# EAGLE design untitled (EAGLE 6.6.0)
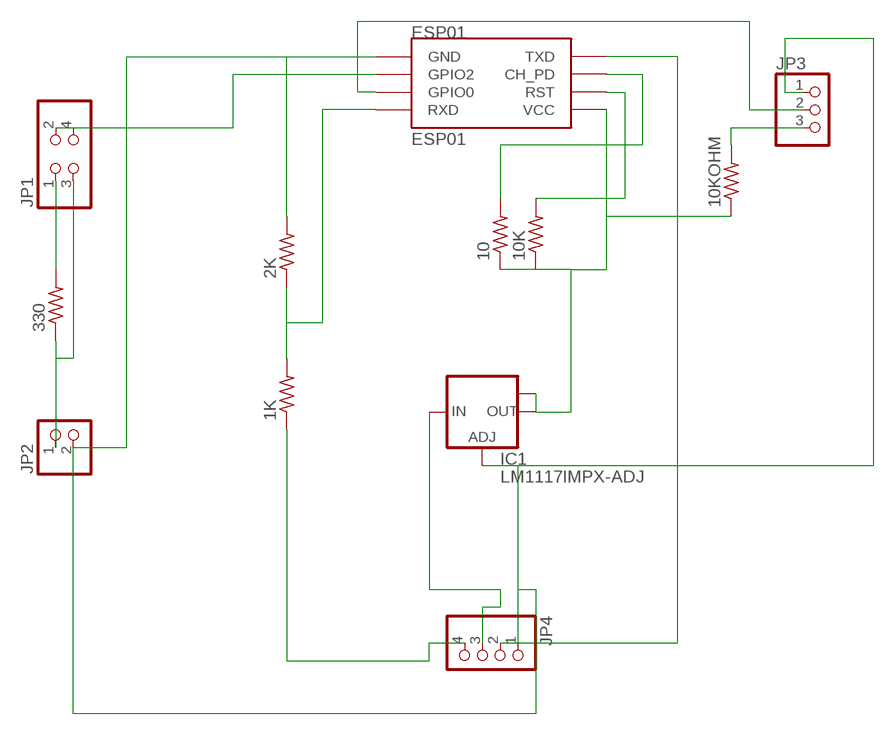
[diagram p0: schematic, sheet 1]

## Parts
1K  R-US_0204/7  [0204/7]
2K  R-US_0204/7  [0204/7]
10  R-US_0204/7  [0204/7]
10K  R-US_0204/7  [0204/7]
10KOHM  R-US_0204/7  [0204/7]
330  R-US_0204/7  [0204/7]
ESP01  ESP01  [ESP01]
IC1  LM1117IMPX-ADJ  [SOT223]
JP1  PINHD-2X2  [2X02]
JP2  PINHD-1X2  [1X02]
JP3  PINHD-1X3  [1X03]
JP4  PINHD-1X4  [1X04]

## Nets
N$1: 330.2 JP1.1
N$2: 330.1 JP1.3 JP2.1
N$3: 1K.2 2K.1 ESP01.RX(RXD)
N$5: 10.1 10K.1 10KOHM.1 ESP01.VCC IC1.2(OUT) IC1.TAB(OUT1)
N$6: 1K.1 JP4.4
N$7: ESP01.GPIO2 JP1.2 JP1.4
N$8: 10.2 ESP01.CH_PD
N$9: 10K.2 ESP01.RST
N$10: IC1.3(IN) JP4.3
N$11: 2K.2 ESP01.GND IC1.1(ADJ) JP2.2 JP3.1 JP4.1
N$12: ESP01.TX(TXD) JP4.2
N$13: ESP01.GPIO0 JP3.2
N$14: 10KOHM.2 JP3.3

## Library data of the parts
1K 2K 10 10K 10KOHM 330 = resistor:R-US_: RESISTOR, American symbol
ESP01 = esp8266modules:ESP01: ESP8266 Wifi module 01
IC1 = lm1117:LM1117IMPX-ADJ
JP1 = pinhead:PINHD-2X2: PIN HEADER
JP2 = pinhead:PINHD-1X2: PIN HEADER
JP3 = pinhead:PINHD-1X3: PIN HEADER
JP4 = pinhead:PINHD-1X4: PIN HEADER

## Board
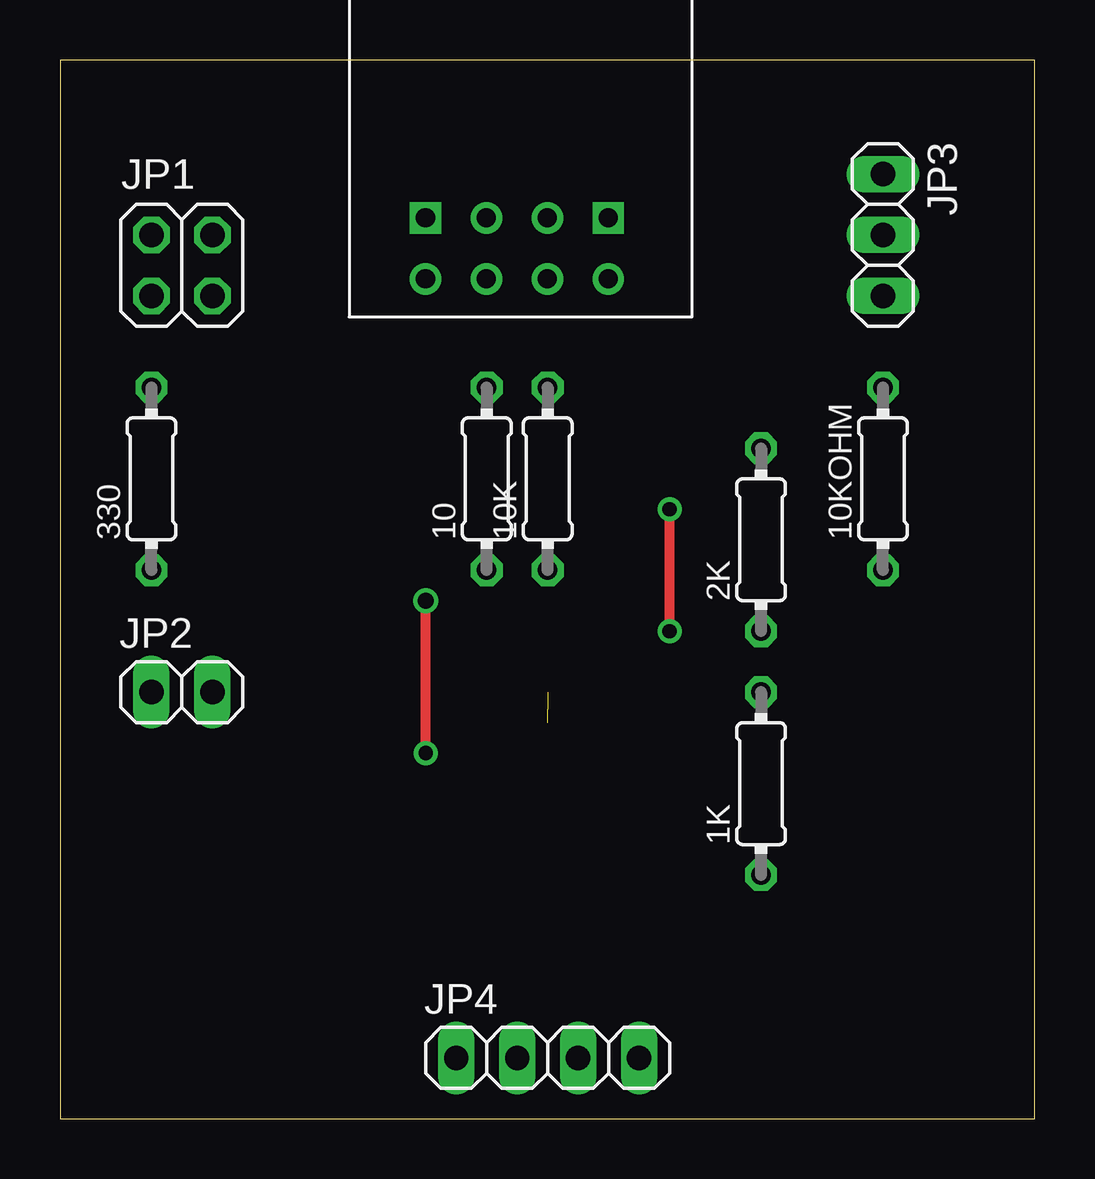
[diagram p1: board, top side]
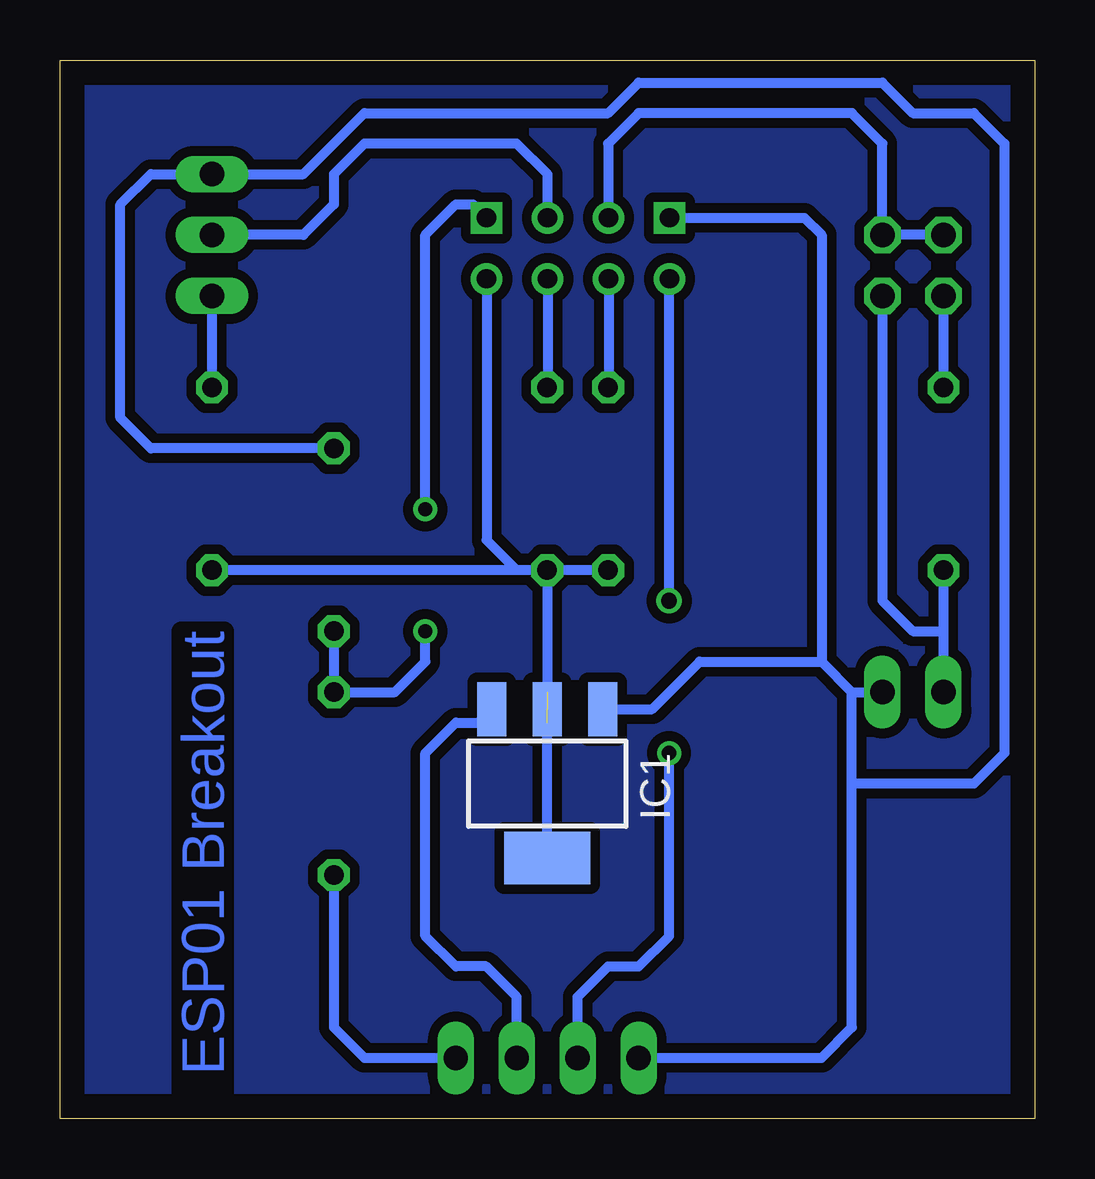
[diagram p2: board, bottom side, seen from below]

Size 40.62 x 44.12 mm. Coordinates in mm from the lower left corner, seen from the top.
Outline: 0,0 40.62,0 40.62,44.12 0,44.12 0,0
Copper layers (1*16): Top 0.035mm / dielectric 1.5mm / Bottom 0.035mm
Design rules "default": minimum track width 10mil, minimum drill 24mil, track to track 8mil, track to pad 8mil, pad to pad 8mil, via to via 8mil, smd to smd 8mil, copper to edge 40mil, drill to drill 8mil, minimum pad ring 10mil, minimum via ring 8mil, stop-mask expansion 4mil, vias tented up to drill 0mil, thermal gap 10mil

### Footprints (pad centres in the part's own frame; a part is rotated, then mirrored left to right if it is on the bottom)
0204/7 = drill 0.813 octagon: 1 -3.81,0; 2 3.81,0
ESP01 = drill 0.8: CH_PD -1.285,-8.178; GPIO0 1.255,-5.638; GPIO2 -1.285,-5.638; RST 1.255,-8.178; TX -3.825,-8.178; VCC 3.795,-8.178 | drill 0.8 square: GND -3.825,-5.638; RX 3.795,-5.638
SOT223 = smd 1.219 x 2.235: 1 -2.311,-3.099; 2 0,-3.099; 3 2.311,-3.099 | smd 3.6 x 2.2: TAB 0,3.099
2X02 = drill 1.016 octagon: 1 -1.27,-1.27; 2 -1.27,1.27; 3 1.27,-1.27; 4 1.27,1.27
1X02 = drill 1.016 long: 1 -1.27,0; 2 1.27,0
1X03 = drill 1.016 long: 1 -2.54,0; 2 0,0; 3 2.54,0
1X04 = drill 1.016 long: 1 -3.81,0; 2 -1.27,0; 3 1.27,0; 4 3.81,0

### Placement (x,y rotation side)
1K  29.21,13.97 90 top
2K  29.21,24.13 90 top
10  17.78,26.67 90 top
10K  20.32,26.67 90 top
10KOHM  34.29,26.67 90 top
330  3.81,26.67 90 top
ESP01  19.05,43.18 0 top
IC1  20.32,13.97 180 bottom
JP1  5.08,35.56 0 top
JP2  5.08,17.78 0 top
JP3  34.29,36.83 270 top
JP4  20.32,2.54 0 top

### Tracks (layer width: path | path; a pad name or v marks a point on that pad's centre or on a via)
GND
  pour Bottom (isolate 0.406): 0,44.45 40.64,44.45 40.64,43.18 40.64,0 0,0 0,1.27
N$1
  Bottom 0.406: JP1.1 330.2
N$2
  Bottom 0.406: 330.1 3.81,20.32 | 3.81,20.32 JP2.1 | JP1.3 6.35,21.59 5.08,20.32 3.81,20.32
N$3  (via drill 0.6)
  Top 0.406: v25.4,20.32 v25.4,25.4
  Bottom 0.406: 2K.1 1K.2 26.67,17.78 25.4,19.05 v25.4,20.32 | v25.4,25.4 25.4,36.83 24.13,38.1 23.4,38.1 ESP01.RX
N$5  (2 unrouted)
  Bottom 0.406: 10.1 10K.1 | 10K.1 21.59,22.86 | 21.59,22.86 10KOHM.1 | 10K.1 20.32,16.51 | IC1.TAB 20.32,17.78 | ESP01.VCC 22.85,24.11 21.59,22.86
N$6
  Bottom 0.406: 1K.1 29.21,3.81 27.94,2.54 JP4.4
N$7
  Bottom 0.406: JP1.2 JP1.4 6.35,40.64 7.62,41.91 16.51,41.91 17.78,40.64 17.78,37.56 ESP01.GPIO2
N$8
  Bottom 0.406: ESP01.CH_PD 17.76,30.5 10.2
N$9
  Bottom 0.406: ESP01.RST 20.3,30.5 10K.2
N$10
  Bottom 0.406: JP4.3 21.59,5.08 22.86,6.35 24.13,6.35 25.4,7.62 25.4,15.24 24.13,16.51 23.19,16.51 IC1.3
N$11
  Bottom 0.406: ESP01.GND 9.6,37.54 8.89,36.83 8.89,19.05 | 8.89,19.05 7.62,17.78 | 7.62,17.78 JP2.2 | IC1.1 15.95,17.07 13.97,19.05 8.89,19.05 | JP4.1 8.89,2.54 7.62,3.81 7.62,13.97 | 7.62,13.97 7.62,17.78 | 2K.2 36.83,27.94 38.1,29.21 38.1,38.1 36.83,39.37 JP3.1 30.48,39.37 27.94,41.91 17.78,41.91 16.51,43.18 6.35,43.18 5.08,41.91 2.54,41.91 1.27,40.64 1.27,15.24 2.54,13.97 7.62,13.97
N$12  (via drill 0.6, 0.65)
  Top 0.406: v15.24,15.24 v15.24,21.59
  Bottom 0.406: JP4.2 19.05,5.08 17.78,6.35 16.51,6.35 15.24,7.62 v15.24,15.24 | v15.24,21.59 15.24,34.99 ESP01.TX
N$13
  Bottom 0.406: ESP01.GPIO0 20.3,39.36 21.59,40.64 27.94,40.64 29.21,39.37 29.21,38.1 30.48,36.83 JP3.2
N$14
  Bottom 0.406: JP3.3 10KOHM.2

### Text on the board
Bottom: ESP01 Breakout